# Altium project Project_3.PrjPcb
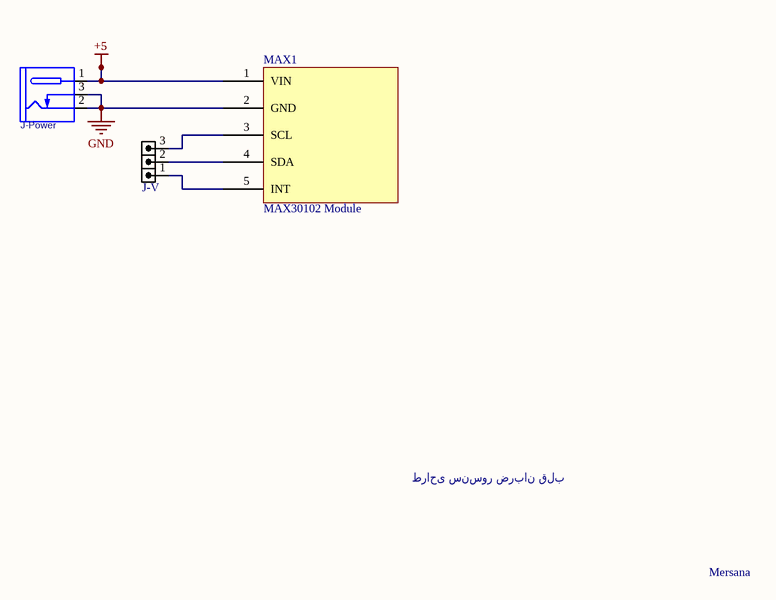
[diagram p0: Sheet1.SchDoc]
1 sheet, 3 parts. Net scope: global (net labels, ports and power ports of the same name join across sheets).
Board file: PCB1.PcbDoc

## Sheet Sheet1.SchDoc
size A4; SheetNumber: 1; SheetTotal: 1

### Parts
J-Power  DC_POWER_JACK  [JAC_PWR2]  (value not drawn)
J-V  HDRM3  [HDR_M_1X3]  (value not drawn)
MAX1  MAX30102 Module  [MAX30102-MODULE]

### Nets
+5: J-Power.1(TIP) MAX1.1(VIN)
GND: J-Power.2(SLEEVE) J-Power.3(INSERTION_DET) MAX1.2(GND)
NetJ-V_1: J-V.1 MAX1.5(INT)
NetJ-V_2: J-V.2 MAX1.4(SDA)
NetJ-V_3: J-V.3 MAX1.3(SCL)

### Notes on the sheet
- طراحی سنسور ضربان قلب
- Mersana

### Library data of the parts
J-Power = CONN_PWR_JACKR2: CONN, PWR JACK DC, PLUG DIAM 2.0MM RA THD; MANF: CUI STACK; MANF_P#: PJ-202A, PJ-002AH, PJ-102AH, KLDX-0202; VALUE: DC_POWER_JACK
J-V = HDR_M_1X3: CONN, HEADER, Male, pitch: 2.54mm, 3POS; VALUE: HDRM3
MAX1 = MODULE-MAX30102: MAX30102, Heart Rate Module